# EAGLE schematic ScaleOffset-R2 (EAGLE 6.5.0)
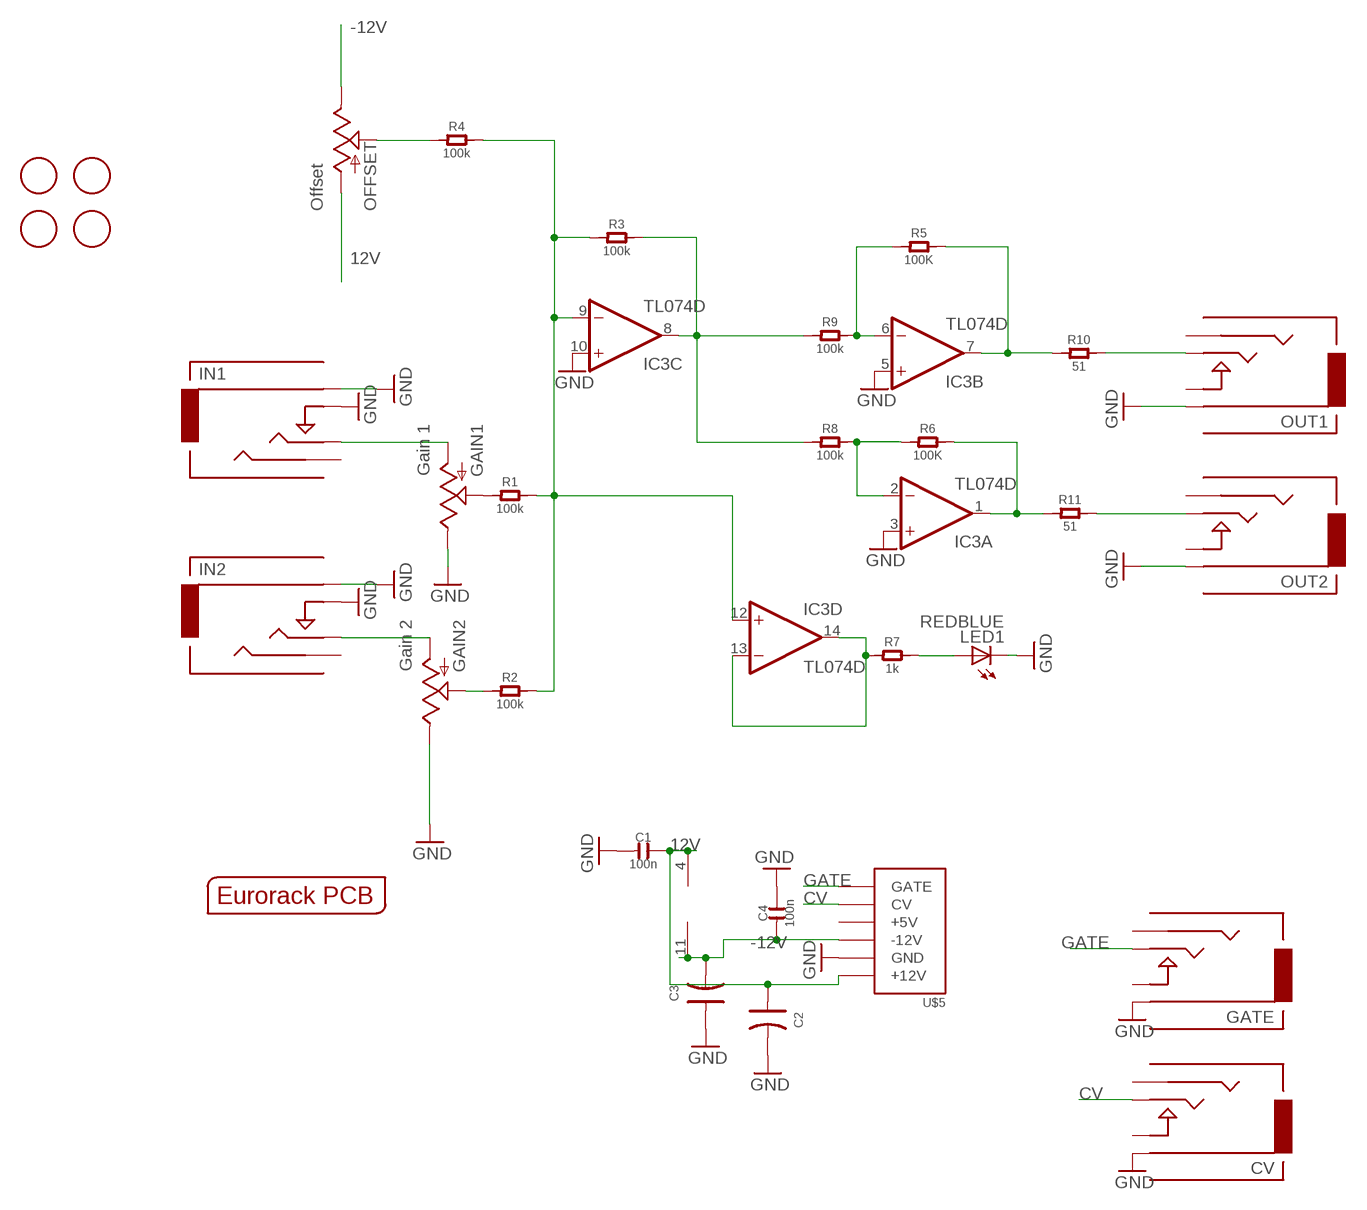
[diagram p0: schematic, sheet 1]

## Parts
C1  100n  C-0603  [C0603]
C2  C-POLAR-A  [AVX-A]
C3  C-POLAR-A  [AVX-A]
C4  100n  C-0603  [C0603]
CV  CV  AUDIO-JACKOUTPUT  [3.5MM-JACK-SWITCH-13MM-OUTPUT]
GAIN1  Gain 1  POTZEPHPOT  [OG-POTS_ALPS_POT_VERTICAL]
GAIN2  Gain 2  POTZEPHPOT  [OG-POTS_ALPS_POT_VERTICAL]
GATE  GATE  AUDIO-JACKOUTPUT  [3.5MM-JACK-SWITCH-13MM-OUTPUT]
IC3  TL074D  [SO14]
IN1  Input 1  AUDIO-JACKINPUT  [3.5MM-JACK-SWITCH-13MM-INPUT]
IN2  Input 2  AUDIO-JACKINPUT  [3.5MM-JACK-SWITCH-13MM-INPUT]
LED1  REDBLUE  LED3MM  [LED3MM]
OFFSET  Offset  POTZEPHPOT  [OG-POTS_ALPS_POT_VERTICAL]
OUT1  2  AUDIO-JACKOUTPUT  [3.5MM-JACK-SWITCH-13MM-OUTPUT]
OUT2  1  AUDIO-JACKOUTPUT  [3.5MM-JACK-SWITCH-13MM-OUTPUT]
R1  100k  R-0603  [R0603]
R2  100k  R-0603  [R0603]
R3  100k  R-0603  [R0603]
R4  100k  R-0603  [R0603]
R5  100K  R-0603  [R0603]
R6  100K  R-0603  [R0603]
R7  1k  R-0603  [R0603]
R8  100k  R-0603  [R0603]
R9  100k  R-0603  [R0603]
R10  51  R  [C0805]
R11  51  R  [C0805]
U$1  FIDUCIAL  [FIDUCIAL_1MM]
U$2  FIDUCIAL  [FIDUCIAL_1MM]
U$3  FIDUCIAL  [FIDUCIAL_1MM]
U$4  FIDUCIAL  [FIDUCIAL_1MM]
U$5  POWER  [POWER_16]
U$12  EURORACK_PCB6HP  [EURORACK6HPPCB]

## Nets
12V: C1.2 C2.+ IC3.4(P:V+) OFFSET.P$3(A) U$5.9(+12V) U$5.10(+12V)
-12V: C3.- C4.1 IC3.11(P:V-) OFFSET.P$1(E) U$5.1(-12V) U$5.2(-12V)
CV: CV.TIP@1(TIP) CV.TIP@2(TIP) U$5.13(CV) U$5.14(CV)
FBOUT1: IC3.7(B:OUT) R5.2 R10.1
FBOUT2: IC3.1(A:OUT) R6.2 R11.1
GATE: GATE.TIP@1(TIP) GATE.TIP@2(TIP) U$5.15(GATE) U$5.16(GATE)
GND: C1.1 C2.- C3.+ C4.2 CV.RING@1(RING) CV.RING@2(RING) GAIN1.P$1(E) GAIN2.P$1(E) GATE.RING@1(RING) GATE.RING@2(RING) IC3.3(A:+IN) IC3.5(B:+IN) IC3.10(C:+IN) IN1.RING@1(RING) IN1.RING@2(RING) IN1.SWITCH@1(SWITCH) IN1.SWITCH@2(SWITCH) IN2.RING@1(RING) IN2.RING@2(RING) IN2.SWITCH@1(SWITCH) IN2.SWITCH@2(SWITCH) LED1.K(C) OUT1.RING@1(RING) OUT1.RING@2(RING) OUT2.RING@1(RING) OUT2.RING@2(RING) U$5.3(GND) U$5.4(GND) U$5.5(GND) U$5.6(GND) U$5.7(GND) U$5.8(GND)
N$1: IC3.6(B:-IN) R5.1 R9.2
N$2: LED1.A R7.2
N$3: GAIN2.P$3(A) IN2.TIP@1(TIP) IN2.TIP@2(TIP)
N$4: GAIN1.P$3(A) IN1.TIP@1(TIP) IN1.TIP@2(TIP)
N$5: GAIN1.P$2(S) R1.1
N$6: GAIN2.P$2(S) R2.1
N$8: IC3.8(C:OUT) R3.2 R8.1 R9.1
N$11: IC3.13(D:-IN) IC3.14(D:OUT) R7.1
N$12: IC3.2(A:-IN) R6.1 R8.2
OFFSET: OFFSET.P$2(S) R4.1
OUT1: OUT1.TIP@1(TIP) OUT1.TIP@2(TIP) R10.2
OUT2: OUT2.TIP@1(TIP) OUT2.TIP@2(TIP) R11.2
SUMMING: IC3.9(C:-IN) IC3.12(D:+IN) R1.2 R2.2 R3.1 R4.2
Unconnected: CV.SECOND@1(SECOND) CV.SECOND@2(SECOND) CV.SWITCH@1(SWITCH) CV.SWITCH@2(SWITCH) GATE.SECOND@1(SECOND) GATE.SECOND@2(SECOND) GATE.SWITCH@1(SWITCH) GATE.SWITCH@2(SWITCH) IN1.SECOND@1(SECOND) IN1.SECOND@2(SECOND) IN2.SECOND@1(SECOND) IN2.SECOND@2(SECOND) OUT1.SECOND@1(SECOND) OUT1.SECOND@2(SECOND) OUT1.SWITCH@1(SWITCH) OUT1.SWITCH@2(SWITCH) OUT2.SECOND@1(SECOND) OUT2.SECOND@2(SECOND) OUT2.SWITCH@1(SWITCH) OUT2.SWITCH@2(SWITCH) U$5.11(+5V) U$5.12(+5V)

## Library data of the parts
C1 C4 = OPL:C*
C2 C3 = OPL:C-POLAR*
CV GATE IN1 IN2 OUT1 OUT2 = EurorackModularParts:AUDIO-JACK: Switching Mono 3.5mm Audio Jack from Erthenvar.
GAIN1 GAIN2 OFFSET = EurorackModularParts:POT
IC3 = EurorackModularParts:TL074: OP AMP
LED1 = SparkFun-LED:LED: LEDs Standard schematic elements and footprints for 5mm, 3mm, 1206, and 0603 sized LEDs. 5mm - Spark Fun Electronics SKU : COM-00529 (and others)
R1-R11 = OPL:R*
U$1-U$4 = adafruit:FIDUCIAL: For use by pick and place machines to calibrate the vision/machine, 1mm By microbuilder.eu
U$5 = EurorackModularParts:POWER
U$12 = EurorackModularParts:EURORACK_PCB

## Net classes
0 default: width 0.254 mm